# EAGLE design B0 (EAGLE 9.6.2)
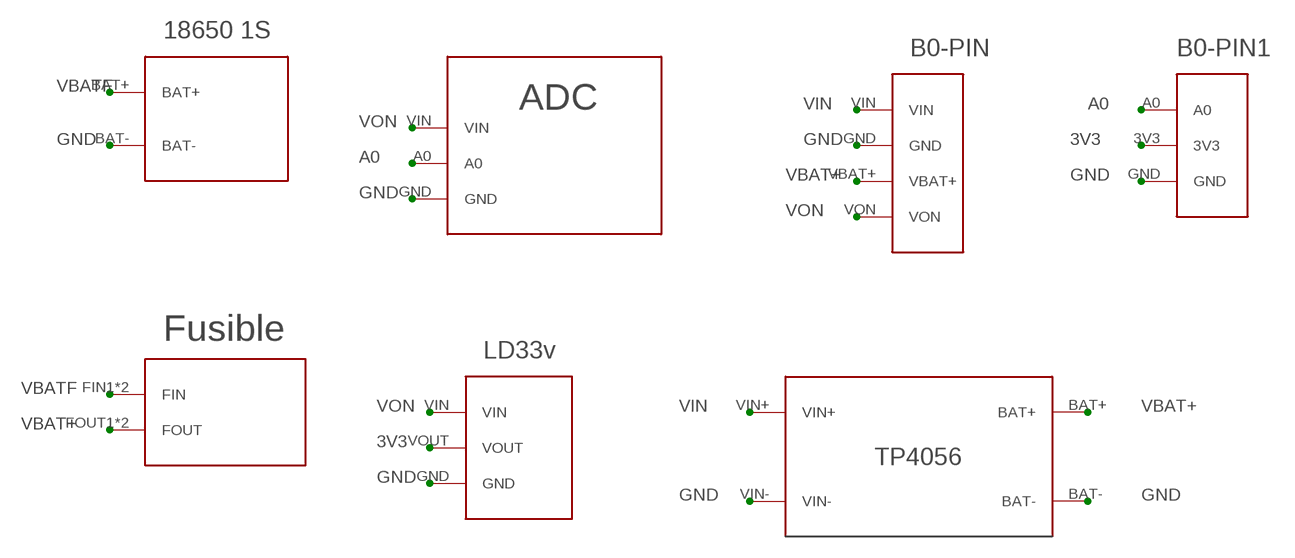
[diagram p0: schematic, sheet 1]

## Parts
U$1  18650-1S  [18650-1S]
U$2  ADC  [ADC]
U$3  B0-PIN  [B0-PIN]
U$4  B0-PIN1  [B0-PIN1]
U$5  FUSIBLE  [FUSIBLE]
U$6  LD33V  [LD33V]
U$7  TP4056  [TP4056]

## Nets
3V3: U$4.3V3 U$6.VOUT
A0: U$2.A0 U$4.A0
GND: U$1.BAT- U$2.GND U$3.GND U$4.GND U$6.GND U$7.BAT- U$7.VIN-
VBAT+: U$3.VBAT+ U$5.FOUT1(FOUT) U$5.FOUT2(FOUT) U$7.BAT+
VBATF: U$1.BAT+ U$5.FIN1(FIN) U$5.FIN2(FIN)
VIN: U$3.VIN U$7.VIN+
VON: U$2.VIN U$3.VON U$6.VIN

## Library data of the parts
U$1 = CANSAT:18650-1S
U$2 = CANSAT:ADC
U$3 = CANSAT:B0-PIN
U$4 = CANSAT:B0-PIN1
U$5 = CANSAT:FUSIBLE
U$6 = CANSAT:LD33V
U$7 = CANSAT:TP4056

## Board
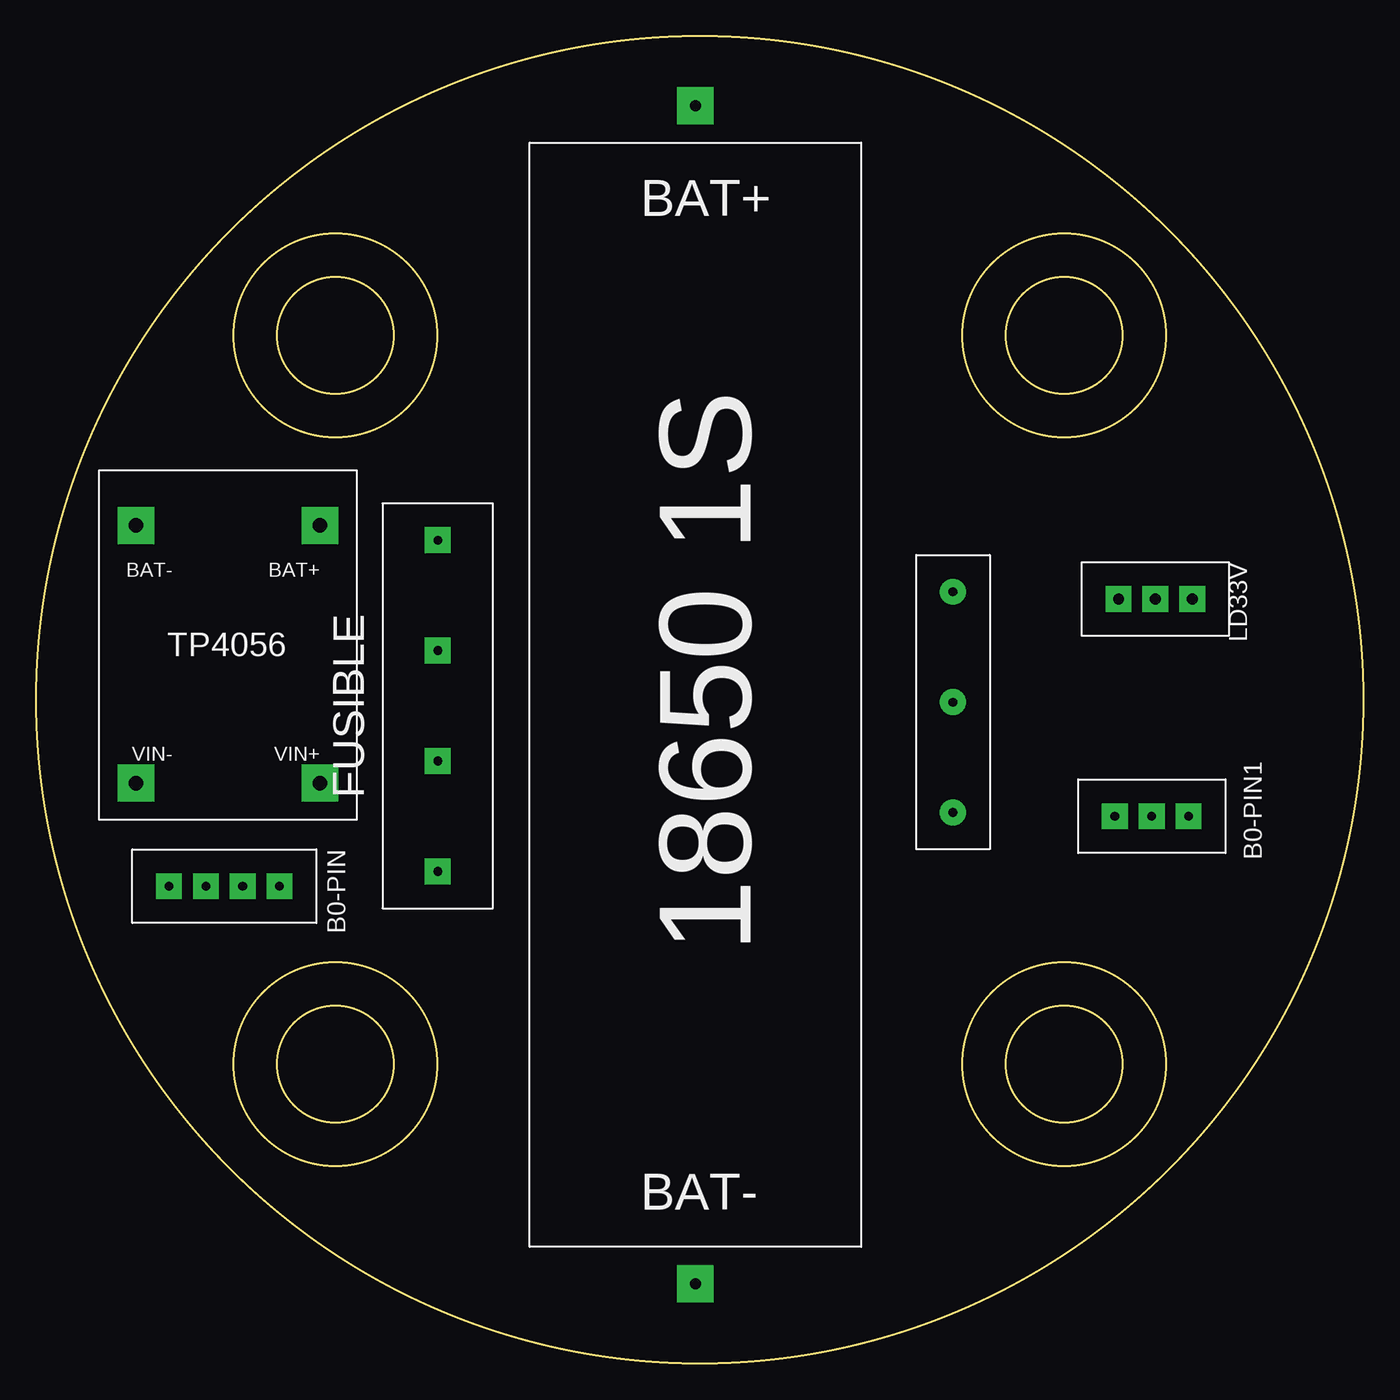
[diagram p1: board, top side]
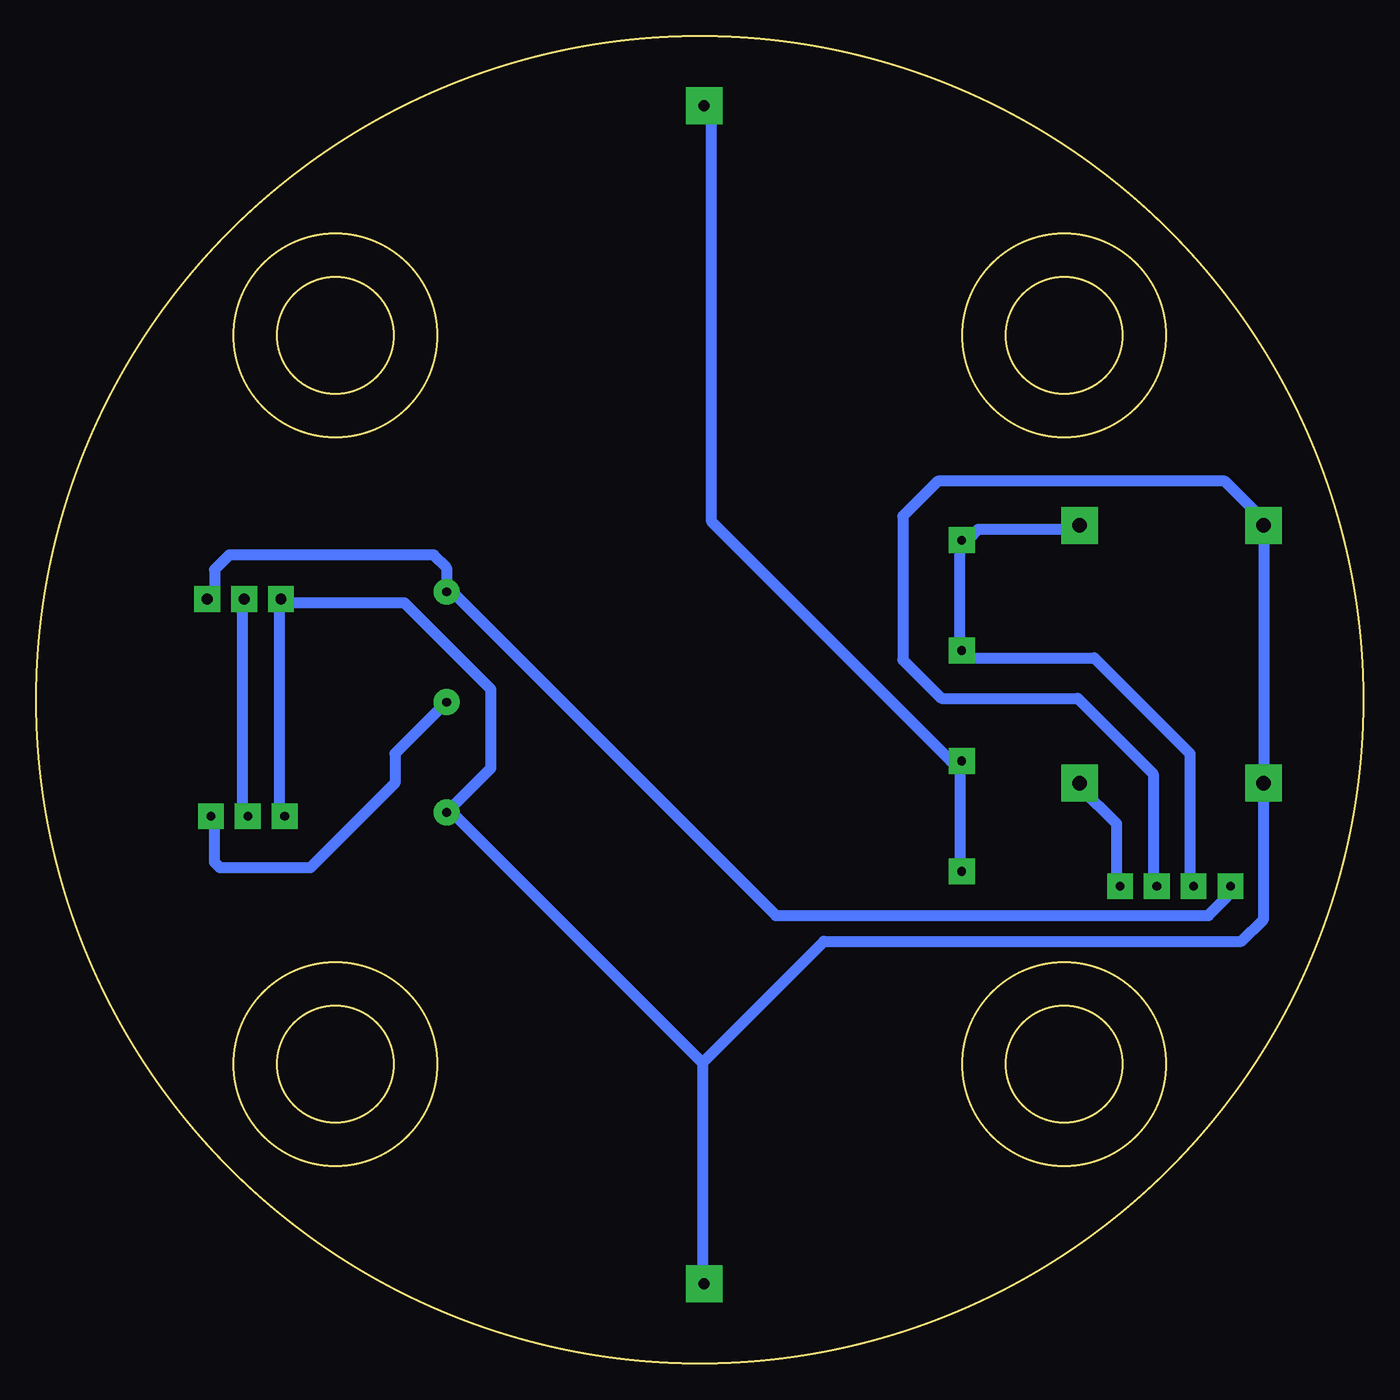
[diagram p2: board, bottom side, seen from below]

Size 91.58 x 91.58 mm. Coordinates in mm from the lower left corner, seen from the top.
Outline: circle at 45.79,45.79 radius 45.79
Outline: circle at 20.65,20.65 radius 4
Outline: circle at 20.65,70.94 radius 4
Outline: circle at 70.94,20.65 radius 4
Outline: circle at 70.94,70.94 radius 4
Outline: circle at 20.65,70.94 radius 7
Outline: circle at 70.94,70.94 radius 7
Outline: circle at 70.94,20.65 radius 7
Outline: circle at 20.65,20.65 radius 7
Copper layers (1*16): Top 0.035mm / dielectric 1.5mm / Bottom 0.035mm
Design rules "default *": minimum track width 30mil, minimum drill 0.35mm, track to track 20mil, track to pad 20mil, pad to pad 6mil, via to via 6mil, smd to smd 6mil, copper to edge 6mil, drill to drill 6mil, minimum pad ring 10mil, minimum via ring 8mil, stop-mask expansion 50mil, vias tented up to drill 0mil, thermal gap 10mil

### Footprints (pad centres in the part's own frame; a part is rotated, then mirrored left to right if it is on the bottom)
18650-1S = drill 0.75 pad 2.54 square: BAT+ 11.43,2.54; BAT- 11.43,-78.74
ADC = drill 0.6 pad 1.778: A0 2.54,-10.16; GND 2.54,-17.78; VIN 2.54,-2.54
B0-PIN = drill 0.6 pad 1.778 square: GND 0,-2.54; VBAT+ 0,-5.08; VIN 0,0; VON 0,-7.62
B0-PIN1 = drill 0.6 pad 1.778 square: 3V3 1.27,-3.81; A0 1.27,-1.27; GND 1.27,-6.35
FUSIBLE = drill 0.6 pad 1.778 square: FIN1 1.27,-1.27; FIN2 8.89,-1.27; FOUT1 16.51,-1.27; FOUT2 24.13,-1.27
LD33V = drill 0.75 pad 1.778 square: GND 0,-5.08; VIN 0,0; VOUT 0,-2.54
TP4056 = drill 1 pad 2.54 square: BAT+ 2.54,-20.32; BAT- 15.24,-20.32; VIN+ 2.54,-2.54; VIN- 15.24,-2.54

### Placement (x,y rotation side)
U$1  34.06,84.24 0 top
U$2  60.73,55.79 0 top
U$3  16.78,32.93 270 top
U$4  80.79,39.02 270 top
U$5  26.44,32.67 90 top
U$6  79.78,52.74 270 top
U$7  22.12,37.5 180 top

### Tracks (layer width: path | path; a pad name or v marks a point on that pad's centre or on a via)
3V3
  Bottom 0.762: U$4.3V3 77.36,37.88 77.36,52.49 U$6.VOUT
A0
  Bottom 0.762: U$2.A0 66.82,42.07 66.82,40.04 72.66,34.2 78.89,34.2 79.27,34.58 79.27,37.25 U$4.A0
GND
  Bottom 0.762: U$3.GND 14.5,33.44 14.5,40.68 19.71,45.88 29.1,45.88 31.77,48.55 31.77,58.46 29.36,60.87 9.55,60.87 6.88,58.2 U$7.BAT- U$7.VIN- 6.88,30.64 8.4,29.12 37.23,29.12 45.61,20.74 | U$4.GND 74.82,37.88 74.82,52.49 U$6.GND 74.19,52.49 66.19,52.49 60.22,46.52 60.22,41.06 U$2.GND 62.76,37.88 45.61,20.74 | 45.61,20.74 45.61,5.5 U$1.BAT-
VBAT+
  Bottom 0.762: U$3.VBAT+ 11.96,33.44 11.96,42.07 18.56,48.68 27.2,48.68 U$5.FOUT1 27.83,49.31 27.83,56.3 U$5.FOUT2 27.2,56.93 26.56,57.57 19.58,57.57 U$7.BAT+
VBATF
  Bottom 0.762: U$5.FIN1 27.83,34.07 27.83,41.06 U$5.FIN2 28.47,41.56 44.98,58.07 44.98,86.78 U$1.BAT+
VIN
  Bottom 0.762: U$3.VIN 17.04,33.44 17.04,37.25 19.58,39.79 U$7.VIN+
VON
  Bottom 0.762: U$3.VON 9.42,32.8 9.42,32.17 10.69,30.9 40.53,30.9 62.76,53.12 U$2.VIN 63.27,54.9 64.16,55.79 78.25,55.79 79.27,54.77 79.27,53.12 U$6.VIN

### Text on the board
tNames: Board 0